# EAGLE design simhid-g1000_bottom (EAGLE 9.6.2)
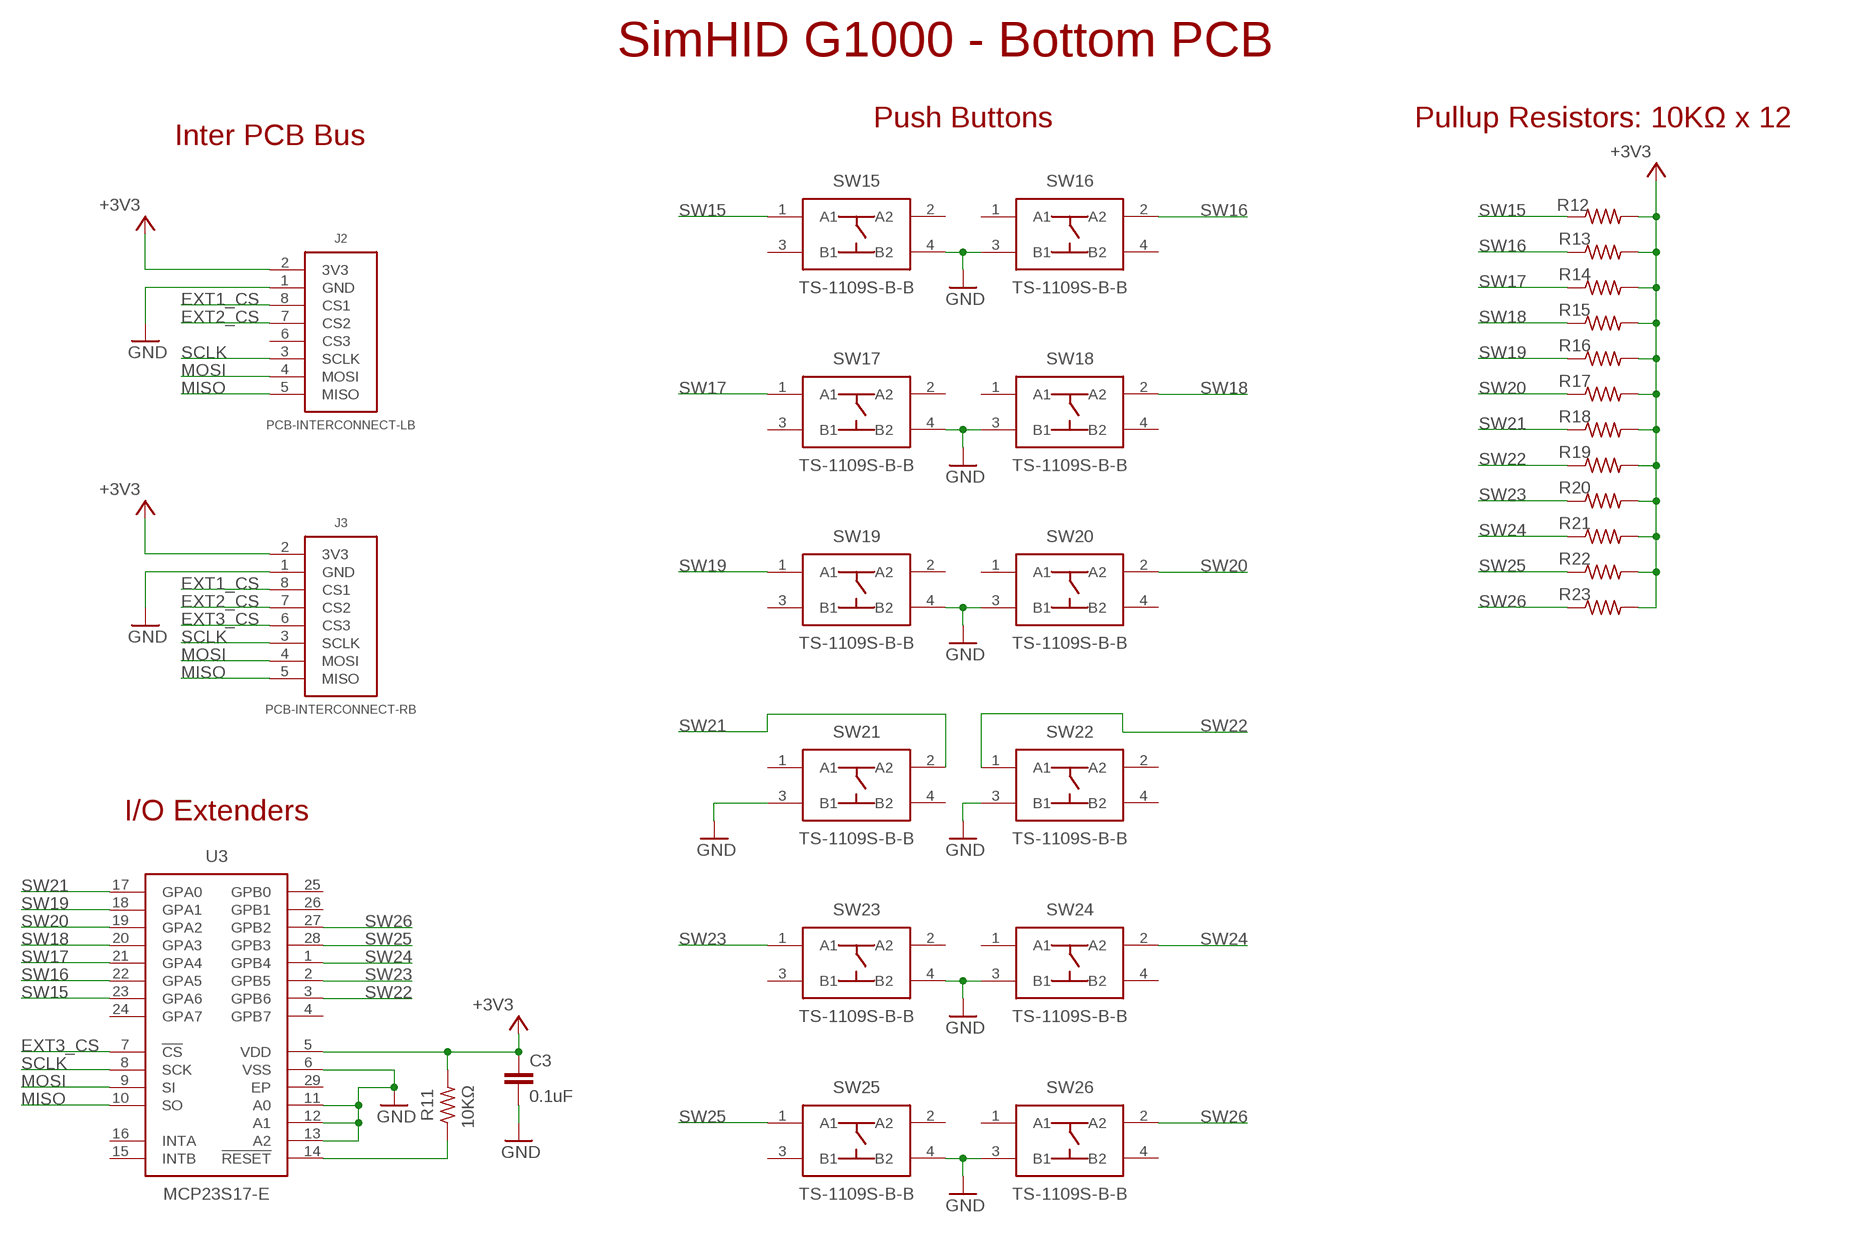
[diagram p0: schematic, sheet 1]

## Parts
C3  0.1uF  RCL_C-EUC0402-HS  [RCL_C0402_HS]
J2  PCB-INTERCONNECT-LB  [PCB-INTERCONNECT-L]
J3  PCB-INTERCONNECT-RB  [PCB-INTERCONNECT-R]
R11  10KΩ  RCL_R-US_R0402-HS  [RCL_R0402_HS]
R12  RCL_R-US_R0402-HS  [RCL_R0402_HS]
R13  RCL_R-US_R0402-HS  [RCL_R0402_HS]
R14  RCL_R-US_R0402-HS  [RCL_R0402_HS]
R15  RCL_R-US_R0402-HS  [RCL_R0402_HS]
R16  RCL_R-US_R0402-HS  [RCL_R0402_HS]
R17  RCL_R-US_R0402-HS  [RCL_R0402_HS]
R18  RCL_R-US_R0402-HS  [RCL_R0402_HS]
R19  RCL_R-US_R0402-HS  [RCL_R0402_HS]
R20  RCL_R-US_R0402-HS  [RCL_R0402_HS]
R21  RCL_R-US_R0402-HS  [RCL_R0402_HS]
R22  RCL_R-US_R0402-HS  [RCL_R0402_HS]
R23  RCL_R-US_R0402-HS  [RCL_R0402_HS]
SW15  TS-1109S-B-B  [TS-1109S-B-B]
SW16  TS-1109S-B-B  [TS-1109S-B-B]
SW17  TS-1109S-B-B  [TS-1109S-B-B]
SW18  TS-1109S-B-B  [TS-1109S-B-B]
SW19  TS-1109S-B-B  [TS-1109S-B-B]
SW20  TS-1109S-B-B  [TS-1109S-B-B]
SW21  TS-1109S-B-B  [TS-1109S-B-B]
SW22  TS-1109S-B-B  [TS-1109S-B-B]
SW23  TS-1109S-B-B  [TS-1109S-B-B]
SW24  TS-1109S-B-B  [TS-1109S-B-B]
SW25  TS-1109S-B-B  [TS-1109S-B-B]
SW26  TS-1109S-B-B  [TS-1109S-B-B]
U3  MCP23S17-E  MCP23S17-E_ML  [QFN65P600X600X100-29N]

## Nets
+3V3: C3.1 J2.2(3V3) J3.2(3V3) R11.2 R12.2 R13.2 R14.2 R15.2 R16.2 R17.2 R18.2 R19.2 R20.2 R21.2 R22.2 R23.2 U3.5(VDD)
EXT1_CS: J2.8(CS1) J3.8(CS1)
EXT2_CS: J2.7(CS2) J3.7(CS2)
EXT3_CS: J3.6(CS3) U3.7(!CS)
GND: C3.2 J2.1(GND) J3.1(GND) SW15.4(B2) SW16.3(B1) SW17.4(B2) SW18.3(B1) SW19.4(B2) SW20.3(B1) SW21.3(B1) SW22.3(B1) SW23.4(B2) SW24.3(B1) SW25.4(B2) SW26.3(B1) U3.6(VSS) U3.11(A0) U3.12(A1) U3.13(A2)
MISO: J2.5(MISO) J3.5(MISO) U3.10(SO)
MOSI: J2.4(MOSI) J3.4(MOSI) U3.9(SI)
RESET: R11.1 U3.14(!RESET)
SCLK: J2.3(SCLK) J3.3(SCLK) U3.8(SCK)
SW15: R12.1 SW15.1(A1) U3.23(GPA6)
SW16: R13.1 SW16.2(A2) U3.22(GPA5)
SW17: R14.1 SW17.1(A1) U3.21(GPA4)
SW18: R15.1 SW18.2(A2) U3.20(GPA3)
SW19: R16.1 SW19.1(A1) U3.18(GPA1)
SW20: R17.1 SW20.2(A2) U3.19(GPA2)
SW21: R18.1 SW21.2(A2) U3.17(GPA0)
SW22: R19.1 SW22.1(A1) U3.3(GPB6)
SW23: R20.1 SW23.1(A1) U3.2(GPB5)
SW24: R21.1 SW24.2(A2) U3.1(GPB4)
SW25: R22.1 SW25.1(A1) U3.28(GPB3)
SW26: R23.1 SW26.2(A2) U3.27(GPB2)
Unconnected: J2.6(CS3) SW15.2(A2) SW15.3(B1) SW16.1(A1) SW16.4(B2) SW17.2(A2) SW17.3(B1) SW18.1(A1) SW18.4(B2) SW19.2(A2) SW19.3(B1) SW20.1(A1) SW20.4(B2) SW21.1(A1) SW21.4(B2) SW22.2(A2) SW22.4(B2) SW23.2(A2) SW23.3(B1) SW24.1(A1) SW24.4(B2) SW25.2(A2) SW25.3(B1) SW26.1(A1) SW26.4(B2) U3.4(GPB7) U3.15(INTB) U3.16(INTA) U3.24(GPA7) U3.25(GPB0) U3.26(GPB1) U3.29(EP)

## Notes on the sheet
- SimHID G1000 - Bottom PCB
- Push Buttons | Pullup Resistors: 10KΩ x 12
- Inter PCB Bus
- I/O Extenders

## Library data of the parts
C3 = gen-discrete3:RCL_C-EU: CAPACITOR, European symbol
J2 J3 = SimHID-G1000:PCB-INTERCONNECT
R11-R23 = gen-discrete3:RCL_R-US_: RESISTOR, American symbol
SW15-SW26 = Switches:TS-1109S-B-B
U3 = MCP23S17-E_ML:MCP23S17-E_ML: 16-Bit I/O Port Expander SPI 10M QFN28EP Microchip MCP23S17-E/ML, 16-channel 16bit I/O Expander 10MHz, Serial-SPI, 28-Pin QFN Source: Datasheet <http://docs-emea.rs-online.com/webdocs/1169/0900766b811692f9.pdf>; ARROW_PART_NUMBER: MCP23S17-E/ML; ARROW_PRICE-STOCK: https://www.arrow.com/en/products/mcp23s17-eml/microchip-technology; DESCRIPTION: 16-Bit I/O Port Expander SPI 10M QFN28EP Microchip MCP23S17-E/ML, 16-channel 16bit I/O Expander 10MHz, Serial-SPI, 28-Pin QFN; HEIGHT: 1mm; MANUFACTURER_NAME: Microchip; MANUFACTURER_PART_NUMBER: MCP23S17-E/ML; MOUSER_PART_NUMBER: 579-MCP23S17-E/ML; MOUSER_PRICE-STOCK: https://www.mouser.co.uk/ProductDetail/Microchip-Technology/MCP23S17-E-ML/?qs=usxtMOJb1RyqBjk32jXtPQ%3D%3D

## Board
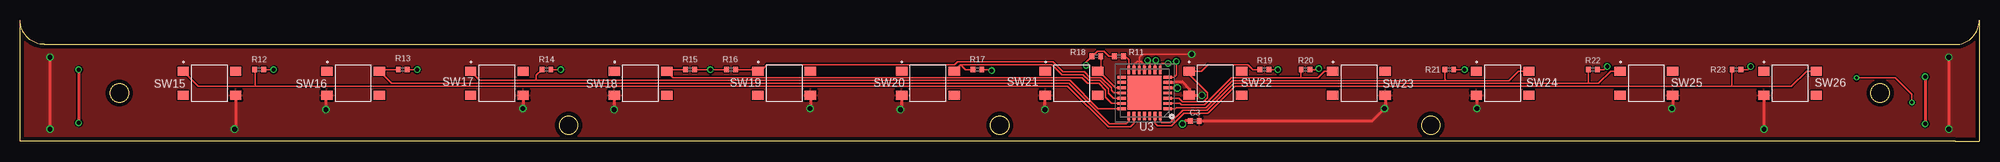
[diagram p1: board, top side]
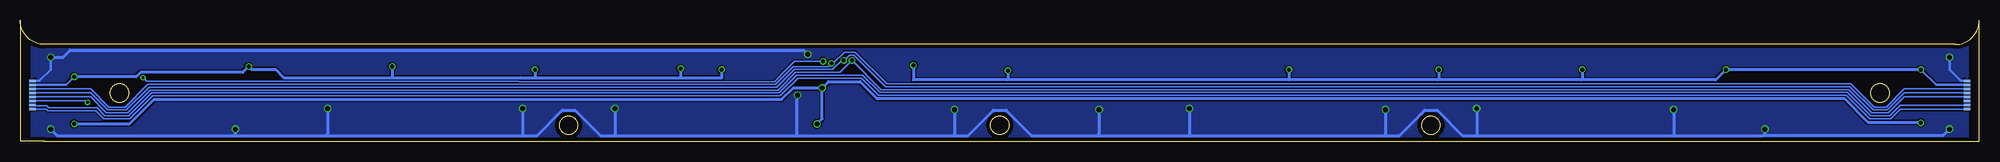
[diagram p2: board, bottom side, seen from below]

Size 242.53 x 15 mm. Coordinates in mm from the lower left corner, seen from the top.
Outline: 0,0 0,15
Outline: 239.53,0 3,0
Outline: 242.53,15 242.53,0
Outline: 3,12 239.53,12
Outline: circle at 67.9,2 radius 1.15
Outline: circle at 12.27,6 radius 1.15
Outline: circle at 174.64,2 radius 1.15
Outline: circle at 230.27,6 radius 1.15
Outline: circle at 121.27,2 radius 1.15
Copper layers (1*16): Top 0.035mm / dielectric 1mm / Bottom 0.035mm
Design rules "Elecrow_2-layer_PCB_eagle_rule *": minimum track width 6mil, minimum drill 12mil, track to track 6mil, track to pad 6mil, pad to pad 6mil, via to via 8mil, smd to smd 0mil, copper to edge 20mil, drill to drill 10mil, minimum pad ring 6mil, minimum via ring 6mil, stop-mask expansion 0mil, vias tented up to drill 100mil, thermal gap 10mil
Holes 2.3 mm at 12.27,6 67.9,2 121.27,2 174.64,2 230.27,6

### Footprints (pad centres in the part's own frame; a part is rotated, then mirrored left to right if it is on the bottom)
RCL_C0402_HS = smd 0.6 x 0.7: 1 -0.55,0; 2 0.55,0
PCB-INTERCONNECT-L = smd 0.8 x 0.3: 1 -1.5,7.5; 2 -1.5,7; 3 -1.5,6.5; 4 -1.5,6; 5 -1.5,5.5; 6 -1.5,5; 7 -1.5,4.5; 8 -1.5,4
PCB-INTERCONNECT-R = smd 0.8 x 0.3: 1 1.5,7.5; 2 1.5,7; 3 1.5,6.5; 4 1.5,6; 5 1.5,5.5; 6 1.5,5; 7 1.5,4.5; 8 1.5,4
RCL_R0402_HS = smd 0.6 x 0.7: 1 -0.55,0; 2 0.55,0
TS-1109S-B-B = smd 1.4 x 1.1: 1 -3.25,1.5; 2 3.25,1.5; 3 -3.25,-1.5; 4 3.25,-1.5
QFN65P600X600X100-29N = smd 1.05 x 0.35: 1 -2.85,1.95; 2 -2.85,1.3; 3 -2.85,0.65; 4 -2.85,0; 5 -2.85,-0.65; 6 -2.85,-1.3; 7 -2.85,-1.95; 15 2.85,-1.95; 16 2.85,-1.3; 17 2.85,-0.65; 18 2.85,0; 19 2.85,0.65; 20 2.85,1.3; 21 2.85,1.95 | smd 0.35 x 1.05: 8 -1.95,-2.85; 9 -1.3,-2.85; 10 -0.65,-2.85; 11 0,-2.85; 12 0.65,-2.85; 13 1.3,-2.85; 14 1.95,-2.85; 22 1.95,2.85; 23 1.3,2.85; 24 0.65,2.85; 25 0,2.85; 26 -0.65,2.85; 27 -1.3,2.85; 28 -1.95,2.85 | smd 4.2 x 4.2: 29 0,0

### Placement (x,y rotation side)
C3  145.41,2.54 0 top
J2  0,0 0 bottom
J3  242.53,0 0 bottom
R11  136.01,10.54 180 top
R12  29.59,8.89 0 top
R13  47.37,8.89 0 top
R14  65.15,8.89 0 top
R15  82.93,8.89 0 top
R16  88.01,8.89 180 top
R17  118.49,8.89 0 top
R18  133.22,10.54 180 top
R19  154.05,8.89 0 top
R20  159.13,8.89 0 top
R21  176.91,8.89 0 top
R22  194.69,8.89 0 top
R23  212.47,8.89 0 top
SW15  23.42,7.2 0 top
SW16  41.21,7.2 0 top
SW17  59,7.2 0 top
SW18  76.79,7.2 0 top
SW19  94.58,7.2 0 top
SW20  112.37,7.2 0 top
SW21  130.16,7.2 0 top
SW22  147.95,7.2 0 top
SW23  165.74,7.2 0 top
SW24  183.53,7.2 0 top
SW25  201.32,7.2 0 top
SW26  219.11,7.2 0 top
U3  139.19,6 180 top

### Tracks (layer width: path | path; a pad name or v marks a point on that pad's centre or on a via)
+3V3  (via drill 0.5, 0.6)
  Top 0.2: v214.25,9.27 213.86,8.89 R23.2 | v196.47,9.27 196.08,8.89 R22.2 | R21.2 v178.81,8.89 | v160.78,9.02 160.65,8.89 R20.2 | R19.2 v155.7,8.89 | v131.95,9.4 131.95,9.82 R18.2 132.76,10.54 133.36,11.14 134.17,11.14 134.78,10.54 R11.2 | R17.2 120.14,8.89 v120.27,8.76 | R15.2 v85.47,8.89 R16.2 | R14.2 v66.92,8.89 | R13.2 v49.15,8.89 | R12.2 v31.36,8.89
  Top 0.35: U3.5 143.21,6.65 v143.25,6.6
  Top 0.4: v235.84,8 v235.84,2.16 | v7.24,8.89 v7.24,2.29 | C3.1 144.27,2.54 v143.89,2.16
  Bottom 0.3: J3.2 236.84,7 v235.84,8 | J2.2 5.34,7 v7.24,8.89
  Bottom 0.4: 196.47,7.89 209.92,7.89 210.93,8.91 213.88,8.91 v214.25,9.27 214.96,8.55 227.61,8.55 228.16,8 v235.84,8 | 196.47,7.89 180.6,7.89 180.59,7.87 178.81,7.87 | 178.81,7.87 160.78,7.87 | 160.78,7.87 155.7,7.87 v155.7,8.89 | 49.27,7.62 67.05,7.62 | 67.05,7.62 85.47,7.62 | 85.47,7.62 120.27,7.62 | 120.27,7.62 131.95,7.62 v131.95,9.4 | v178.81,8.89 178.81,7.87 | v160.78,9.02 160.78,7.87 | v120.27,8.76 120.27,7.62 | v85.47,8.89 85.47,7.62 | v66.92,8.89 66.92,7.75 67.05,7.62 | v49.15,8.89 49.15,7.75 49.27,7.62 | v31.36,8.89 31.36,8.81 | v196.47,9.27 196.47,7.89 | v143.25,6.6 146.85,6.6 148.26,5.19 225.94,5.19 228.98,2.16 v235.84,2.16 | v143.25,6.6 142.47,7.39 138.56,7.39 136.44,5.26 16.66,5.26 13.78,2.38 7.33,2.38 v7.24,2.29 | v7.24,8.89 v31.36,8.89 | v31.36,8.89 32.63,7.62 49.27,7.62 | v143.89,2.16 143.25,2.79 v143.25,6.6
EXT1_CS
  Bottom 0.2: J3.8 239.33,4 239.14,3.81 233.16,3.81 232.19,2.83 228.94,2.83 226.13,5.64 148.44,5.64 146.25,7.84 138.37,7.84 136.25,5.71 16.47,5.71 13.59,2.83 10.96,2.83 9.79,4 J2.8
EXT2_CS
  Bottom 0.2: J3.7 240.94,4.4 239.24,4.4 239,4.16 233.02,4.16 232.04,3.19 229.09,3.19 226.28,6 148.59,6 146.4,8.19 138.23,8.19 136.1,6.07 16.32,6.07 13.44,3.19 11.1,3.19 9.79,4.5 J2.7
EXT3_CS  (via drill 0.35, 0.5)
  Top 0.2: U3.7 142.82,7.95 143.12,8.26 v143.12,9.91 | v234.19,4.83 234.19,5.84 232.16,7.87 v227.33,7.87
  Bottom 0.2: v143.12,9.91 146.68,9.91 147.7,8.89 147.7,8.88 149.18,7.41 180.76,7.41 180.79,7.44 226.9,7.44 v227.33,7.87 | J3.6 234.36,5 v234.19,4.83
GND  (via drill 0.6)
  Top 0.2: U3.12 138.54,9.91 | 138.54,9.91 138.54,10.4 138.93,10.79 v145.03,10.79 | U3.11 139.19,9.49 138.77,9.91 138.54,9.91 | U3.13 137.89,9.49 138.3,9.91 138.54,9.91
  Top 0.35: U3.6 142.84,7.3 142.93,7.38 143.87,7.38 144.78,6.48 144.78,5.63
  Top 0.4: SW26.3 215.86,1.56 v215.9,1.52 | SW25.4 204.57,4.17 v204.47,4.06 | SW24.3 180.34,5.65 v180.34,4.06 | SW23.4 168.99,4.15 v168.91,4.06 167.38,2.54 C3.2 | 144.78,5.63 SW22.3 146.28,5.7 v146.3,5.71 | SW20.3 109.12,4.1 v108.96,3.94 | SW19.4 97.83,4.11 v97.79,4.06 | SW18.3 73.54,3.95 v73.53,3.94 | SW17.4 62.25,4.09 v62.23,4.06 | SW16.3 37.84,5.58 v37.84,3.94 | SW15.4 26.67,1.66 v26.54,1.52 | v126.87,3.94 126.87,5.66 SW21.3 | v238.76,10.41 v238.76,1.52 | v3.68,10.41 v3.68,1.52
  Bottom 0.3: J3.1 240.15,7.5 238.76,8.89 v238.76,10.41 | J2.1 2.29,7.5 3.68,8.89 v3.68,10.41
  Bottom 0.4: 216.15,0.71 204.72,0.71 | 204.72,0.71 180.34,0.71 | 180.34,0.71 178.57,0.71 175.42,3.86 173.86,3.86 170.71,0.71 168.78,0.71 | 168.78,0.71 146.43,0.71 | 146.43,0.71 126.74,0.71 | 126.74,0.71 125.2,0.71 122.05,3.86 120.49,3.86 117.34,0.71 109.22,0.71 | 109.22,0.71 97.79,0.71 | 97.79,0.71 73.66,0.71 | 73.66,0.71 71.82,0.71 69.27,3.26 69.22,3.32 69.15,3.37 68.67,3.86 67.12,3.86 63.97,0.71 62.23,0.71 | 62.23,0.71 37.84,0.71 | 37.84,0.71 26.79,0.71 | v204.47,4.06 204.47,0.96 204.72,0.71 | v180.34,4.06 180.34,0.71 | v168.91,4.06 168.91,0.83 168.78,0.71 | v108.96,3.94 108.96,0.96 109.22,0.71 | v97.79,4.06 97.79,0.71 | v73.53,3.94 73.53,0.83 73.66,0.71 | v62.23,4.06 62.23,0.71 | v37.84,3.94 37.84,0.71 | v26.54,1.52 26.54,0.96 26.79,0.71 | v145.03,10.79 145.53,11.29 236.36,11.29 237.24,10.41 v238.76,10.41 | v215.9,1.52 215.9,0.96 216.15,0.71 | v146.3,5.71 146.43,5.59 146.43,0.71 | v126.87,3.94 126.87,0.83 126.74,0.71 | v238.76,1.52 237.94,0.71 216.15,0.71 | v3.68,1.52 4.5,0.71 26.79,0.71
  pour Top: -0.89,0 -0.89,15.24 244.22,15.24 244.22,0
  pour Bottom: 241.17,-1.27 1.39,-1.27 1.39,13.34 241.17,13.34
MISO  (via drill 0.5)
  Top 0.2: U3.10 139.84,9.76 v139.57,10.03
  Bottom 0.2: J3.5 233.83,5.5 231.86,3.54 229.24,3.54 226.43,6.35 148.74,6.35 146.54,8.55 141.06,8.55 v139.57,10.03 135.96,6.42 16.18,6.42 13.3,3.54 11.25,3.54 9.28,5.5 J2.5
MOSI  (via drill 0.5)
  Top 0.2: U3.9 140.49,9.94 v140.59,10.03
  Bottom 0.2: J3.4 233.83,6 231.72,3.89 229.38,3.89 226.57,6.7 148.88,6.7 146.69,8.9 141.94,8.9 140.8,10.03 v140.59,10.03 140.5,10.03 139.84,10.69 139.3,10.69 135.38,6.77 16.03,6.77 13.15,3.89 11.39,3.89 9.28,6 J2.4
RESET
  Top 0.2: U3.14 137.24,10.08 136.78,10.54 R11.1
SCLK  (via drill 0.5)
  Top 0.2: U3.8 141.14,9.44 141.35,9.65 v142.11,9.65
  Bottom 0.2: J3.3 233.83,6.5 231.57,4.24 229.53,4.24 226.72,7.05 149.03,7.05 147.34,8.74 146.84,9.25 142.51,9.25 v142.11,9.65 141.89,9.65 140.5,11.04 139.15,11.04 135.24,7.12 15.89,7.12 13.01,4.24 11.54,4.24 9.28,6.5 J2.3
SW15
  Top 0.2: 29.08,6.84 22.03,6.84 SW15.1 | R12.1 29.08,8.85 29.08,6.84 | U3.23 137.89,2.26 137.44,1.81 134.7,1.81 129.67,6.84 29.08,6.84
SW16
  Top 0.2: 44.55,8.61 45.97,7.19 129.81,7.19 134.85,2.16 136.9,2.16 137.24,2.5 U3.22 | 44.55,8.61 SW16.2 | R13.1 44.83,8.89 44.55,8.61
SW17
  Top 0.2: 63.88,7.54 129.96,7.54 133.46,4.05 U3.21 | 63.88,7.54 56.91,7.54 SW17.1 | R14.1 63.88,8.17 63.88,7.54
SW18
  Top 0.2: R15.1 80.23,8.89 SW18.2 80.84,7.9 131.44,7.9 132.14,7.19 133.53,7.19 134.36,6.36 134.36,5.46 135.12,4.7 U3.20
SW19
  Top 0.2: R16.1 91.14,8.89 SW19.1 91.48,8.55 92.43,9.5 115.67,9.5 116.02,9.86 127.86,9.86 129.12,8.6 131.73,8.6 132.43,7.9 133.82,7.9 135.07,6.65 135.07,6.35 135.42,6 U3.18
SW20
  Top 0.2: SW20.2 116.42,9.5 | 116.42,9.5 127.72,9.5 128.97,8.25 131.58,8.25 132.29,7.54 133.68,7.54 134.72,6.5 134.72,5.97 135.34,5.35 U3.19 | 116.42,9.5 117.04,8.89 R17.1
SW21
  Top 0.2: R18.1 133.77,9.06 SW21.2 133.86,8.25 133.97,8.25 135.57,6.65 U3.17
SW22
  Top 0.2: R19.1 152.62,8.89 152.01,9.5 147.04,9.5 146.24,8.7 SW22.1 144.7,8.31 147,6.01 147,5.42 146.48,4.9 143.9,4.9 143.44,5.35 U3.3
SW23
  Top 0.2: SW23.1 161.48,8.7 160.65,7.87 158.62,7.87 | 158.62,7.87 149.95,7.87 146.62,4.54 143.75,4.54 143.6,4.7 U3.2 | R20.1 158.58,7.92 158.62,7.87
SW24
  Top 0.2: SW24.2 185.48,8.7 184.3,7.52 176.53,7.52 | 176.53,7.52 150.1,7.52 146.77,4.19 143.13,4.19 142.98,4.05 U3.1 | R21.1 176.36,7.69 176.53,7.52
SW25
  Top 0.2: SW25.1 196.91,8.7 195.38,7.17 194.18,7.17 | 194.18,7.17 150.25,7.17 146.92,3.84 143.92,3.84 142.36,2.29 141.35,2.29 141.14,2.5 U3.28 | R22.1 194.14,7.21 194.18,7.17
SW26
  Top 0.2: SW26.2 221.17,8.7 219.28,6.82 211.96,6.82 211.92,6.86 | R23.1 211.92,6.86 | U3.27 140.49,2.26 140.81,1.93 142.51,1.93 144.06,3.49 147.06,3.49 150.39,6.82 211.88,6.82 211.92,6.86